# EAGLE design 310_usb_memory (EAGLE 7.4.0)
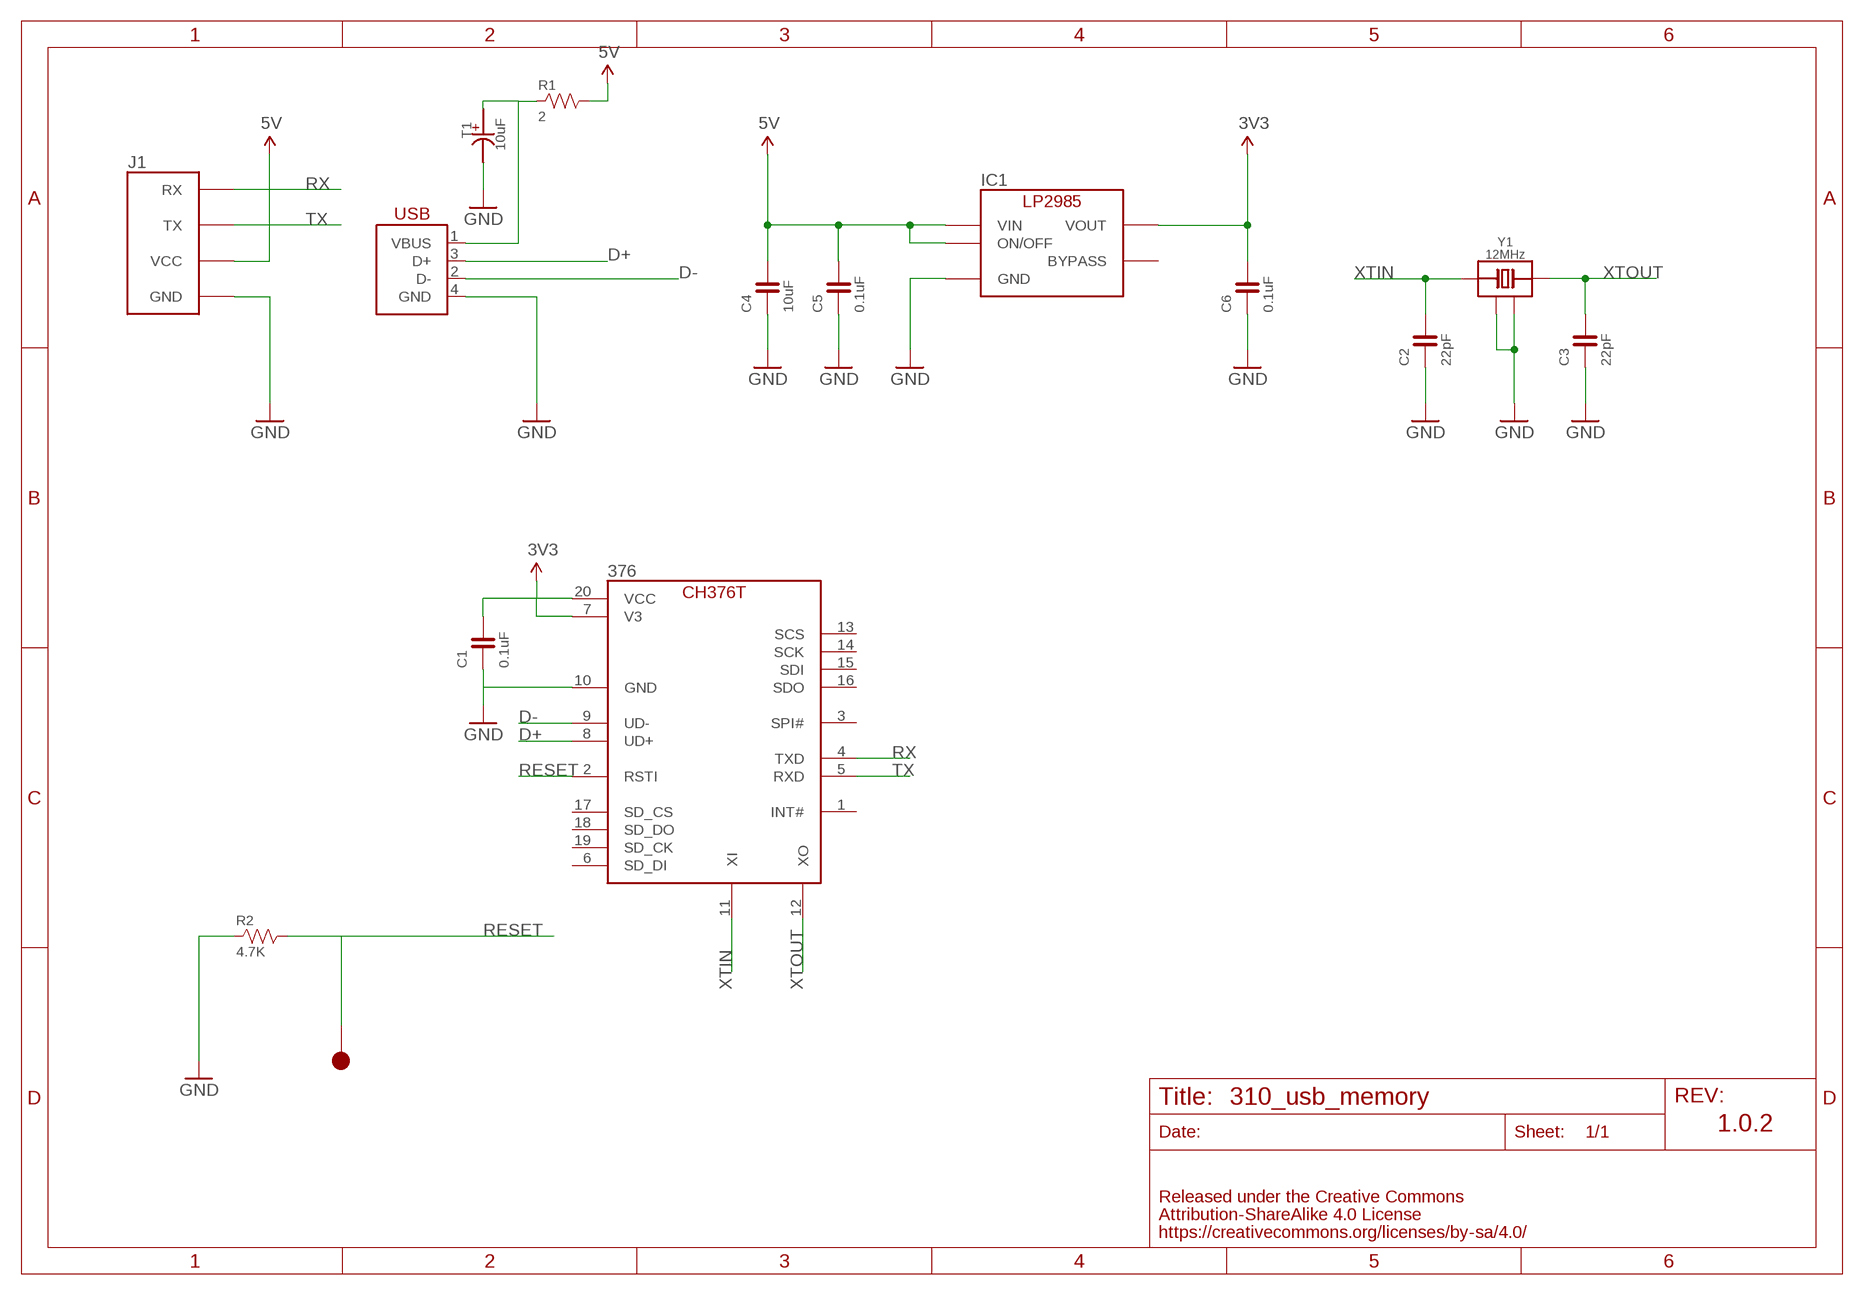
[diagram p0: schematic, sheet 1]

## Parts
376  CH376T  [SSOP-20]
C1  0.1uF  CAPACITOR-0603_NARROW  [0603-NARROW]
C2  22pF  CAPACITOR-0603_NARROW  [0603-NARROW]
C3  22pF  CAPACITOR-0603_NARROW  [0603-NARROW]
C4  10uF  CAPACITOR-0603_NARROW  [0603-NARROW]
C5  0.1uF  CAPACITOR-0603_NARROW  [0603-NARROW]
C6  0.1uF  CAPACITOR-0603_NARROW  [0603-NARROW]
IC1  LP2985-33DBV  [SOT-23-5]
J1  FABO_BRICK_SERIAL  [FABO_BRICK_SERIAL]
R1  2  RESISTOR-0603  [0603]
R2  4.7K  RESISTOR-0603  [0603]
T1  10uF  CAPACITOR-TANTULM  [1206-TANTULM]
TP1  TP-15  [TP-15]
USB1  USB-B_PTH  [USB-4AF103BS]
Y1  12MHz  CRYSTAL-ECS-120-12-33Q  [ECS-12MHZ]

## Nets
3V3: 376.7(V3) 376.20(VCC) C1.2 C6.2 IC1.5(VOUT)
5V: C4.2 C5.2 IC1.1(VIN) IC1.3(ON/OFF) J1.VCC R1.2
D+: 376.8(UD+) USB1.3(D+)
D-: 376.9(UD-) USB1.2(D-)
GND: 376.10(GND) C1.1 C2.1 C3.1 C4.1 C5.1 C6.1 IC1.2(GND) J1.GND R2.1 T1.- USB1.4(GND) Y1.2(GND) Y1.4(GND)
N$1: R1.1 T1.+ USB1.1(VBUS)
RESET: 376.2(RSTI) R2.2 TP1.1
RX: 376.4(TXD) J1.RX
TX: 376.5(RXD) J1.TX
XTIN: 376.11(XI) C2.2 Y1.1(IO)
XTOUT: 376.12(XO) C3.2 Y1.3(IO)
Unconnected: 376.1(INT#) 376.3(SPI#) 376.6(SD_DI) 376.13(SCS) 376.14(SCK) 376.15(SDI) 376.16(SDO) 376.17(SD_CS) 376.18(SD_DO) 376.19(SD_CK) IC1.4(BYPASS)

## Notes on the sheet
- 1.0.2

## Library data of the parts
376 = FaBo-USB:CH376T
C1-C6 = FaBo-Capacitor:CAPACITOR: CAPACITOR
IC1 = FaBo-Supply:LP2985: LP2985
J1 = FaBo-Template:FABO_BRICK_SERIAL: FaBo Brick Serial
R1 R2 = FaBo-Resistors:RESISTOR: RESISTOR
T1 = FaBo-Capacitor:CAPACITOR-TANTULM
TP1 = FaBo-Supply:TP
USB1 = FaBo-USB:USB
Y1 = FaBo-Crystal:CRYSTAL-ECS

## Board
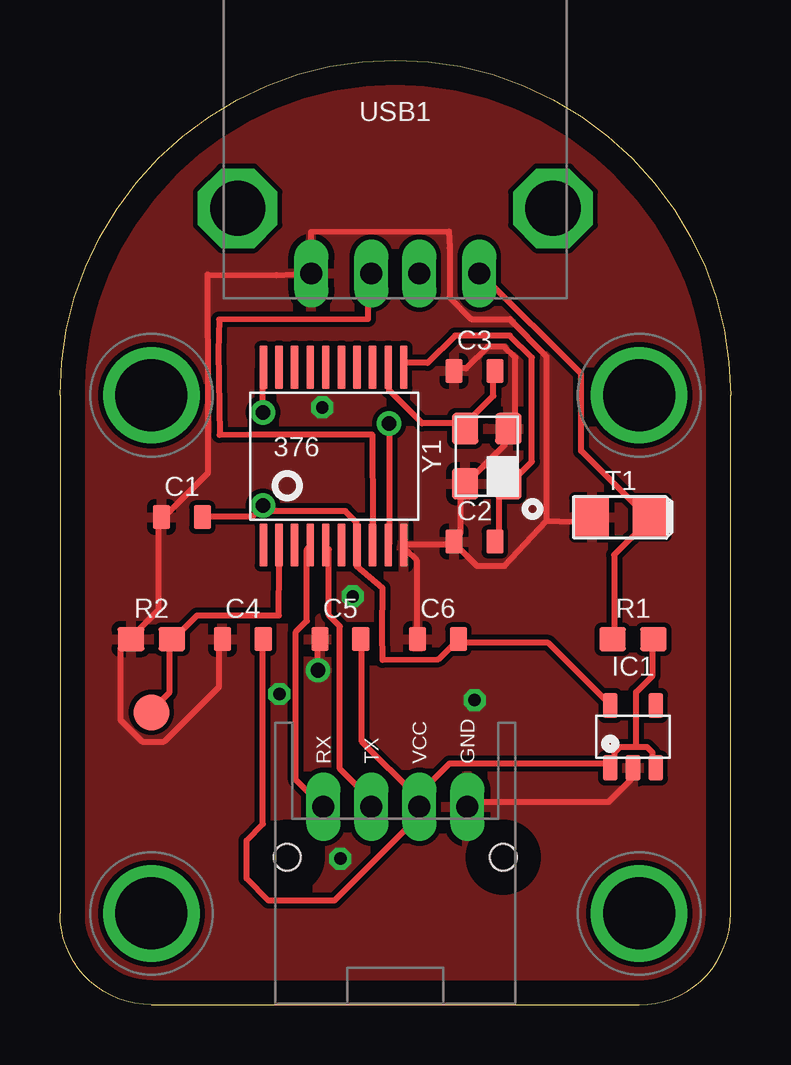
[diagram p1: board, top side]
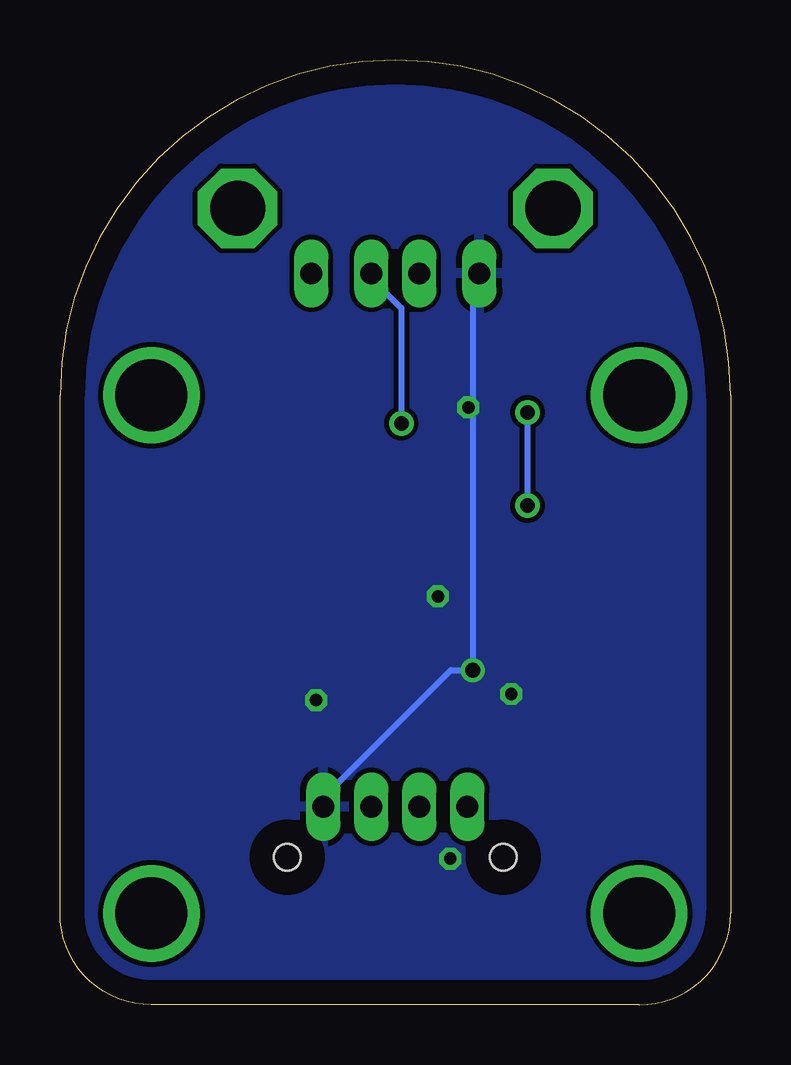
[diagram p2: board, bottom side, seen from below]

Size 27.94 x 39.37 mm. Coordinates in mm from the lower left corner, seen from the top.
Copper layers (1*16): Top 0.035mm / dielectric 1.5mm / Bottom 0.035mm
Design rules "default": minimum track width 10mil, minimum drill 24mil, track to track 8mil, track to pad 8mil, pad to pad 8mil, via to via 8mil, smd to smd 8mil, copper to edge 40mil, drill to drill 8mil, minimum pad ring 10mil, minimum via ring 8mil, stop-mask expansion 4mil, vias tented up to drill 0mil, thermal gap 10mil

### Footprints (pad centres in the part's own frame; a part is rotated, then mirrored left to right if it is on the bottom)
SSOP-20 = smd 0.32 x 1.8: 1 -2.955,-3.7; 2 -2.305,-3.7; 3 -1.655,-3.7; 4 -1.005,-3.7; 5 -0.355,-3.7; 6 0.295,-3.7; 7 0.945,-3.7; 8 1.595,-3.7; 9 2.245,-3.7; 10 2.895,-3.7; 11 2.895,3.7; 12 2.245,3.7; 13 1.595,3.7; 14 0.945,3.7; 15 0.295,3.7; 16 -0.355,3.7; 17 -1.005,3.7; 18 -1.655,3.7; 19 -2.305,3.7; 20 -2.955,3.7
0603-NARROW = smd 0.71 x 1: 1 -0.85,0; 2 0.85,0
SOT-23-5 = smd 0.6 x 1.05: 1 -0.95,-1.3; 2 0,-1.3; 3 0.95,-1.3; 4 0.95,1.3; 5 -0.95,1.3
FABO_BRICK_SERIAL = drill 0.9 pad 1.422 long: GND 3,-10.795; RX -3,-10.795; TX -1,-10.795; VCC 1,-10.795 | drill 3 pad 3.81: P$1 -10.16,6.35; P$2 10.16,6.35; P$3 -10.16,-15.24; P$4 10.16,-15.24 | hole 1.1: -4.5,-12.895; 4.5,-12.895
0603 = smd 1.1 x 1: 1 -0.85,0; 2 0.85,0
1206-TANTULM = smd 1.4 x 1.6: + 1.2,0; - -1.2,0
TP-15 = smd 1.5 x 1.5: 1 0,0
USB-4AF103BS = drill 0.9 long: 1 3.5,0; 2 1,0; 3 -1,0; 4 -3.5,0 | drill 2.3 octagon: P$1 -6.57,2.71; P$2 6.57,2.71
ECS-12MHZ = smd 1.3 x 1.1: 1 -1.15,-0.9; 2 1.15,-0.9; 3 1.15,0.9; 4 -1.15,0.9

### Placement (x,y rotation side)
376  11.43,22.86 0 top
C1  5.08,20.32 0 top
C2  17.27,19.3 0 top
C3  17.27,26.42 0 top
C4  7.62,15.24 0 top
C5  11.68,15.24 0 top
C6  15.75,15.24 0 top
IC1  23.88,11.18 0 top
J1  13.97,19.05 0 top
R1  23.88,15.24 0 top
R2  3.81,15.24 0 top
T1  23.37,20.32 0 top
TP1  3.81,12.19 0 top
USB1  13.97,30.48 0 top
Y1  17.78,22.86 90 top

### Tracks (layer width: path | path; a pad name or v marks a point on that pad's centre or on a via)
3V3  (via drill 0.61)
  Top 0.254: IC1.5 22.86,12.57 20.34,15.09 16.69,15.09 C6.2 16.46,15.09 15.77,14.4 13.44,14.38 13.41,15.52 13.44,17.37 12.34,18.29 12.34,18.97 376.7 12.34,19.2 12.34,20.12 11.89,20.57 8.46,20.57 | 8.46,20.57 8.23,20.57 8,20.34 5.94,20.34 C1.2 | v8.46,24.69 8.46,26.52 376.20 | 8.46,20.57 v8.46,20.8
  Bottom 0.254: v8.46,20.8 v8.46,24.69
5V
  Top 0.254: 24,10.74 24.46,10.74 24.69,10.52 24.69,10.06 IC1.3 | 24,10.74 23.32,10.74 23.09,10.52 23.09,10.06 IC1.1 22.86,10.06 16.23,10.06 14.86,8.69 | 24,10.74 24,13.03 24.69,13.72 24.69,15.09 R1.2 | C4.2 8.46,15.09 8.46,7.54 7.77,6.86 7.77,5.26 8.69,4.34 11.43,4.34 14.86,7.77 14.86,8.23 J1.VCC | 14.86,8.69 15.09,8.46 J1.VCC | 14.86,8.69 12.57,10.97 12.57,15.09 C5.2 | 14.86,8.69 J1.VCC
D+
  Top 0.254: 376.8 13.03,19.2 13.03,20.12 13.01,23.77 8,23.77 6.66,23.75 6.6,27.23 6.63,28.55 12.83,28.57 12.8,30.4 USB1.3
D-  (via drill 0.61)
  Top 0.254: v13.72,24.23 13.72,19.2 376.9
  Bottom 0.254: v13.72,24.23 13.72,29.03 15.09,30.4 USB1.2
GND  (via drill 0.51, 0.61)
  Top 0.254: v10.74,13.95 10.74,15.09 C5.1 | IC1.2 23.77,9.83 23.77,9.37 22.86,8.46 17.14,8.46 J1.GND | C3.1 16.46,26.52 16.92,26.52 17.83,27.43 18.52,27.43 18.97,26.98 18.97,24.46 18.75,24.23 Y1.2 18.52,24 18.52,23.32 16.92,21.72 Y1.4 16.69,21.49 16.69,19.66 16.46,19.43 C2.1 | C6.1 14.86,15.32 14.86,18.52 14.4,18.97 376.10 14.4,19.2 16.23,19.2 C2.1 | 20.27,20.17 21.95,20.12 T1.- | 20.27,20.17 18.52,18.29 17.37,18.29 16.46,19.2 C2.1 | C4.1 6.63,15.09 6.63,13.26 4.34,10.97 3.43,10.97 2.52,11.89 2.52,14.86 2.74,15.09 R2.1 2.97,15.32 4.12,16.46 4.12,20.12 C1.1 4.34,20.34 6.17,22.17 6.17,26.52 6.15,29.03 6.15,30.43 9.02,30.4 USB1.4 10.52,30.63 10.46,32.21 16.2,32.23 16.23,31.55 16.23,29.49 17.14,28.57 18.75,28.57 20.27,27.03 20.27,20.17
  Bottom 0.254: J1.GND 17.14,8.46 11.66,13.95 v10.74,13.95 10.74,30.18 10.52,30.4 USB1.4
  other vias: 17.27,12.7 10.92,24.89 12.19,17.02 9.14,12.95 11.68,6.1
  pour Bottom: -0.25,0 28.45,-0.25 28.7,39.62 -0.25,39.62
  pour Top: 0,0 28.45,-0.25 28.7,39.62 -0.25,39.62 -0.25,0
N$1
  Top 0.254: R1.1 23.09,15.32 23.09,18.75 24.46,20.12 T1.+ 24.46,20.34 21.72,23.09 21.72,26.29 17.6,30.4 USB1.1
RESET
  Top 0.254: TP1.1 3.89,12.34 4.57,13.03 4.57,15.09 R2.2 4.8,15.32 5.71,16.23 9.12,16.23 9.14,18.29 9.14,18.97 376.2
RX
  Top 0.254: 376.4 10.29,18.97 10.29,16 9.83,15.54 9.83,9.37 10.74,8.46 J1.RX
TX
  Top 0.254: 376.5 11.2,18.97 11.2,16.23 11.66,15.77 11.66,9.83 13.03,8.46 J1.TX
XTIN
  Top 0.254: C2.2 18.29,19.43 18.29,21.26 18.52,21.49 Y1.1 18.75,21.72 19.66,22.63 19.66,26.98 18.75,27.89 16.46,27.89 15.32,26.75 14.4,26.75 376.11
XTOUT
  Top 0.254: C3.2 18.06,26.29 18.06,25.38 16.92,24.23 Y1.3 16.69,24.23 15.09,24.23 13.72,25.6 13.72,26.52 376.12